# EasyEDA schematic SCH_后置放大.json
TITLE: 后置放大; REV: 1.0; Date: 2022-10-14; Sheet: 1/1; Drawn By: Banzhuan3721; Company: 垃圾桶
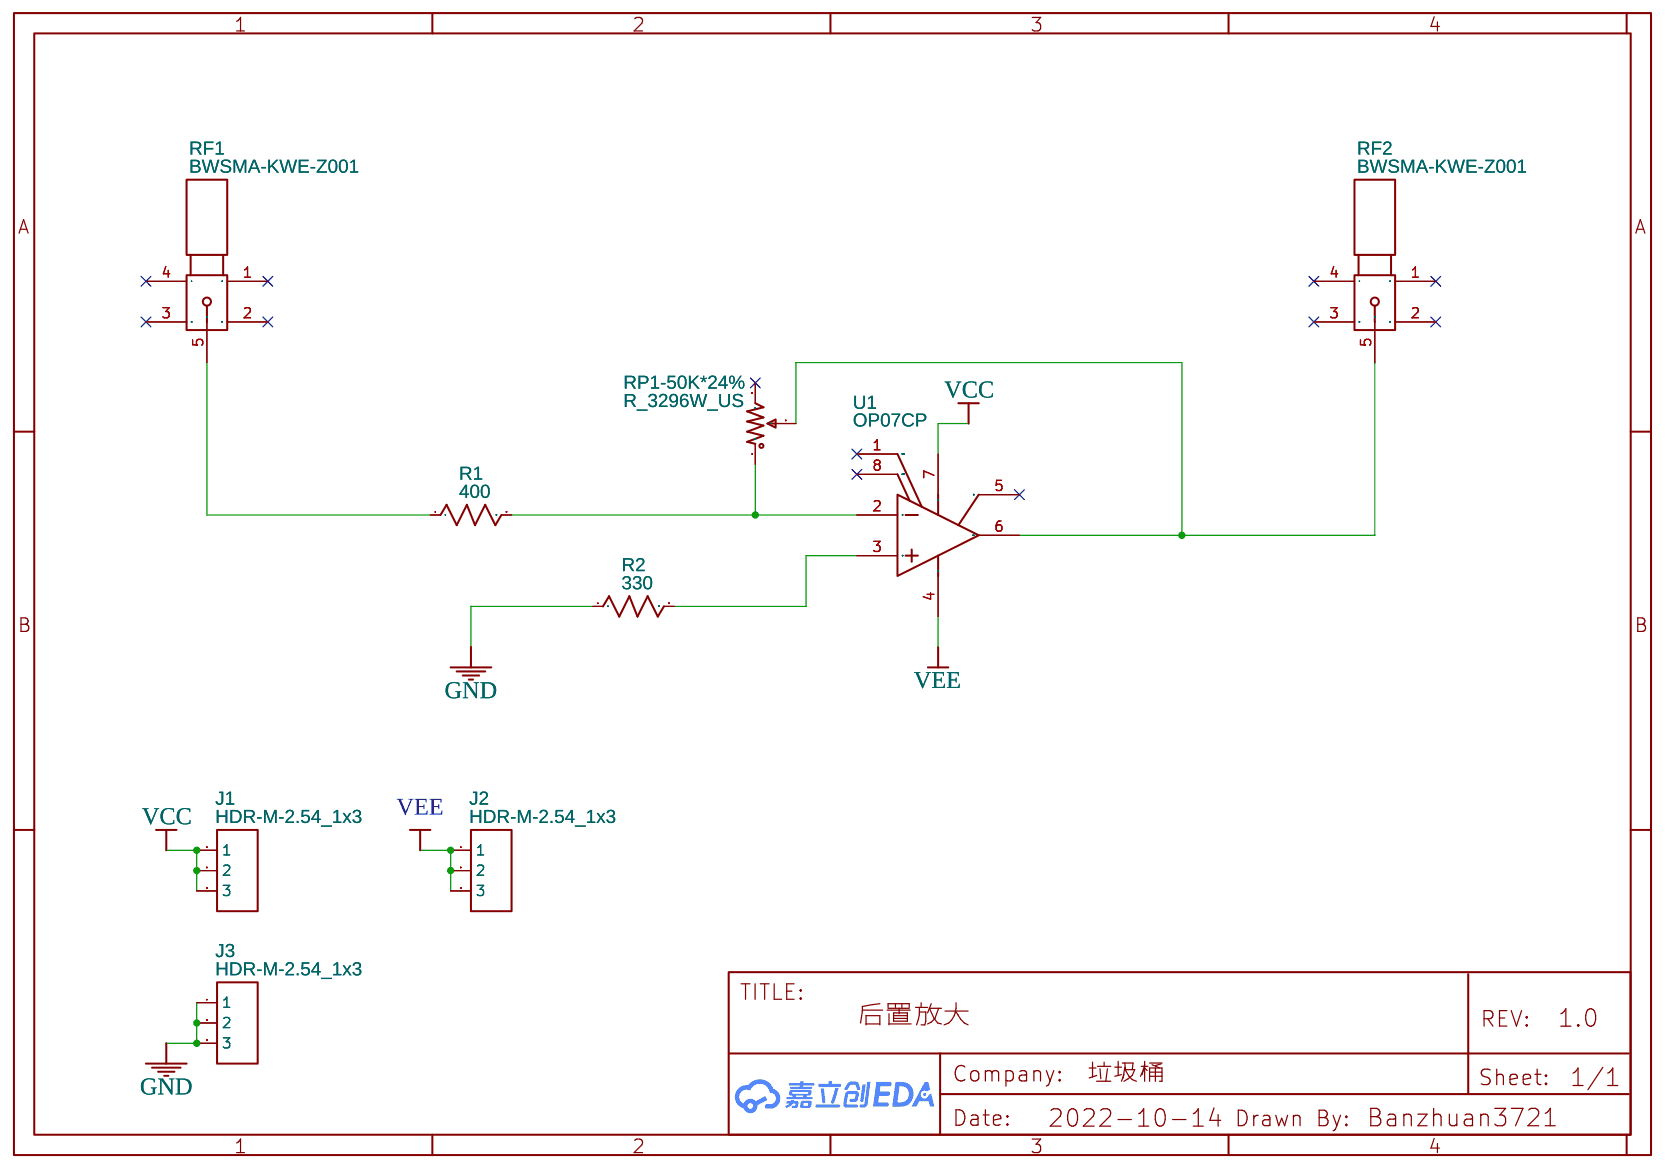
[diagram p0: schematic sheet]

## Parts
J1  HDR-M-2.54_1x3  [HDR-M-2.54_1X3]
J2  HDR-M-2.54_1x3  [HDR-M-2.54_1X3]
J3  HDR-M-2.54_1x3  [HDR-M-2.54_1X3]
R1  400  [R_AXIAL-0.3]
R2  330  [R_AXIAL-0.3]
RF1  BWSMA-KWE-Z001  [SMA-TH_BWSMA-KWE-Z001]
RF2  BWSMA-KWE-Z001  [SMA-TH_BWSMA-KWE-Z001]
RP1-50K*24%  R_3296W_US  [RES-ADJ-TH_3296W]
U1  OP07CP  [DIP-8_L9.6-W6.4-P2.54-LS7.6-BL-1]

## Library data of the parts
J1-J3 = HDR-M-2.54_1x3: Supplier Part: C180248; Supplier: LCSC; Contributor: LCEDA_Lib
R1 R2 = R_AXIAL-0.3_US: Contributor: LCEDA_Lib
RF1 RF2 = BWSMA-KWE-Z001: Supplier: LCSC; Supplier Part: C496551; Manufacturer: BAT WIRELESS; Contributor: LCSC; JLCPCB Part Class: Extended Part
RP1-50K*24% = R_3296W_US: Supplier: LCSC; Contributor: LCEDA_Lib; value(Ω): 10K
U1 = OP07CP: Supplier: LCSC; Manufacturer: TI; Supplier Part: C5224; JLCPCB Part Class: Extended Part

## Nets
GND: J3.1 J3.2 J3.3 R2.1
VCC: J1.1 J1.2 J1.3 U1.7(VCC+)
VEE: J2.1 J2.2 J2.3 U1.4(VCC-)
Net-(R1-1): R1.1 RF1.5
Net-(R1-2): R1.2 RP1-50K*24%.1 U1.2(IN-)
Net-(R2-2): R2.2 U1.3(IN+)
Net-(RF2-5): RF2.5 RP1-50K*24%.2 U1.6(OUT)

Not connected (* = marked no-connect by the designer): RF1 1* 2* 3* 4*; RF2 1* 2* 3* 4*; RP1-50K*24% 3*; U1 1(OFFSET_N1)* 5(NC)* 8(OFFSET_N2)*
